# EAGLE design multi-pcb-cpu2 (EAGLE 9.6.2)
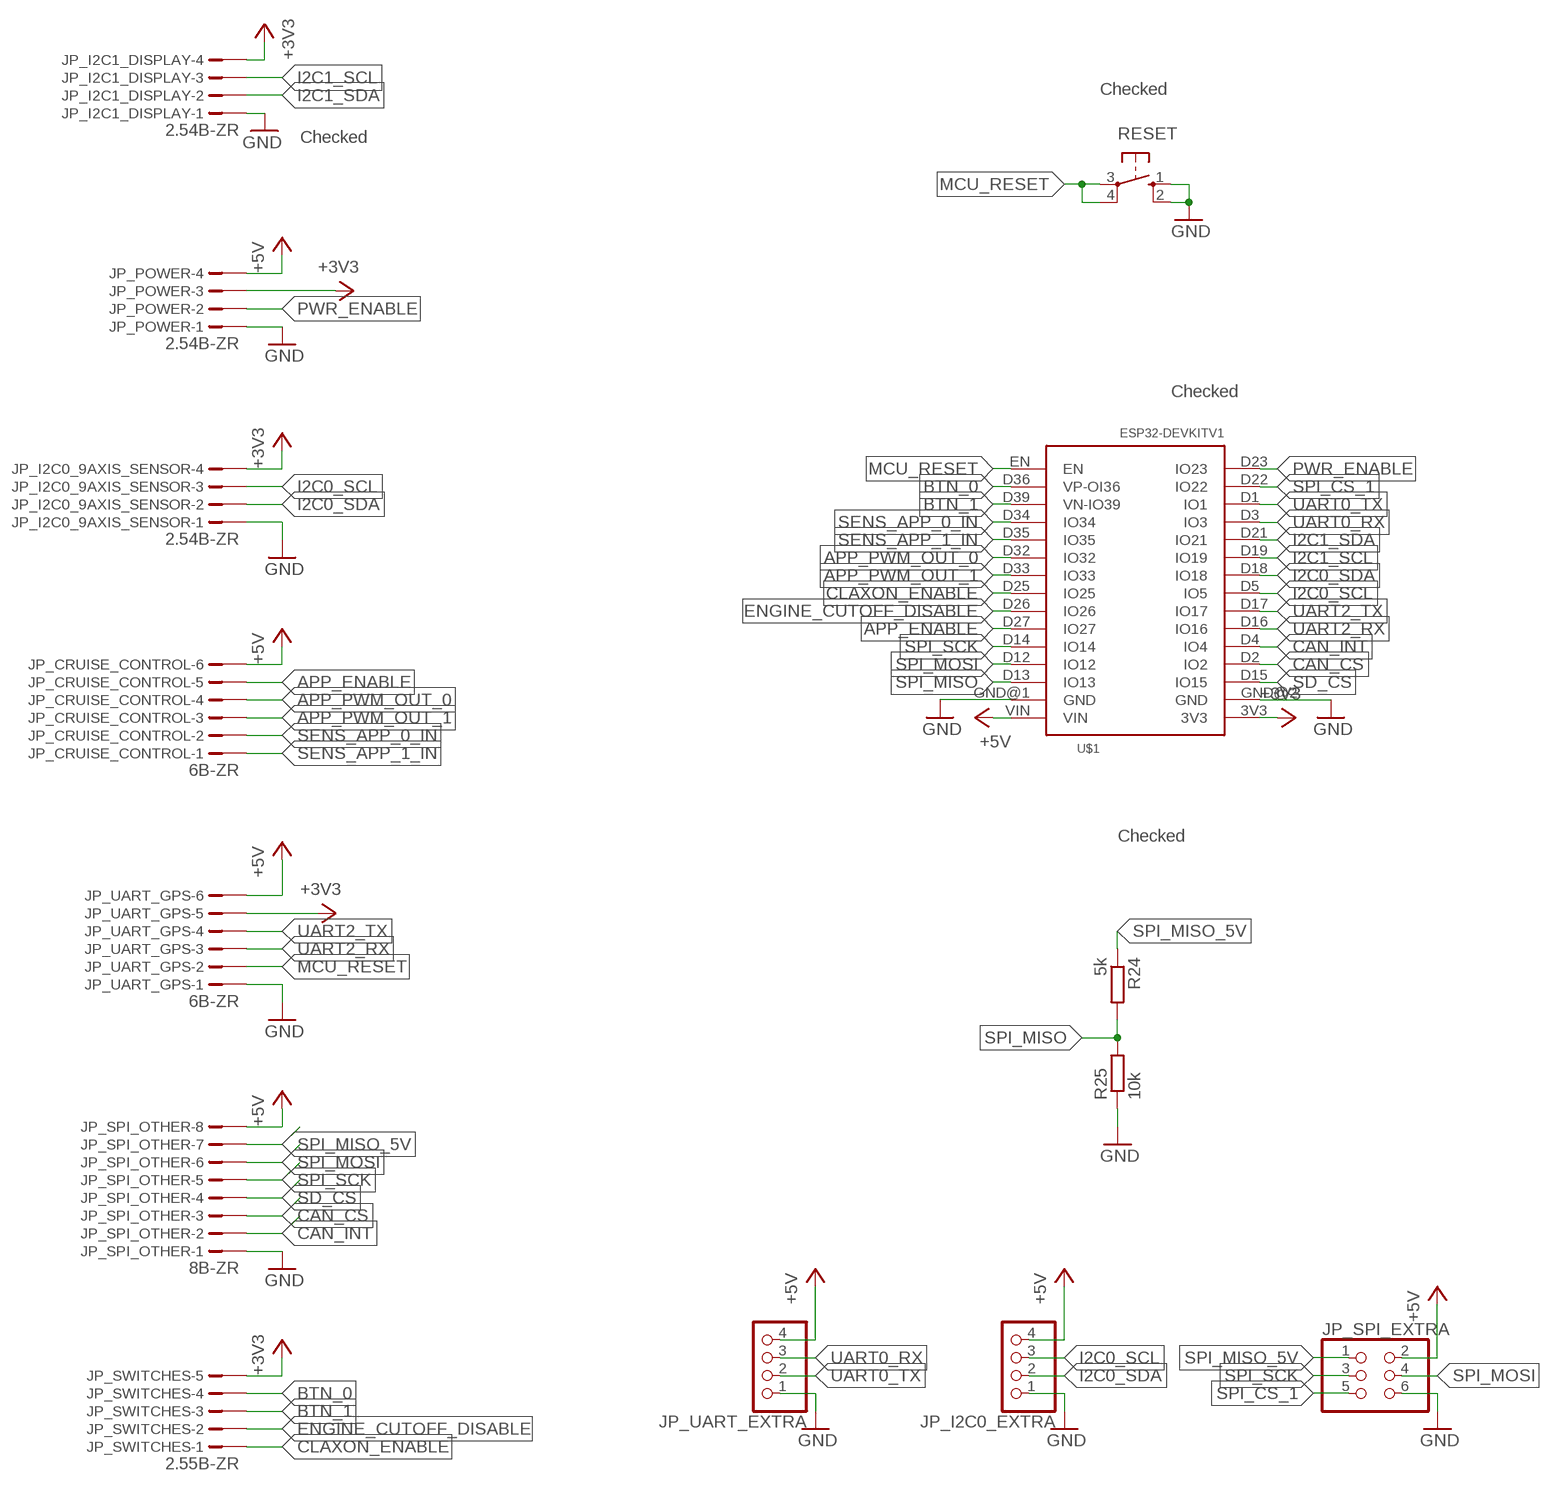
[diagram p0: schematic, sheet 1]

## Parts
JP_CRUISE_CONTROL  6B-ZR  [B6B-ZR2.5]
JP_I2C0_9AXIS_SENSOR  2.54B-ZR  [B4B-ZR2.5]
JP_I2C0_EXTRA  PINHD-1X4  [1X04]
JP_I2C1_DISPLAY  2.54B-ZR  [B4B-ZR2.5]
JP_POWER  2.54B-ZR  [B4B-ZR2.5]
JP_SPI_EXTRA  PINHD-2X3  [2X03]
JP_SPI_OTHER  8B-ZR  [B8B-ZR2.5]
JP_SWITCHES  2.55B-ZR  [B5B-ZR2.5]
JP_UART_EXTRA  PINHD-1X4  [1X04]
JP_UART_GPS  6B-ZR  [B6B-ZR2.5]
R24  5k  R-EU_0207/7  [0207/7]
R25  10k  R-EU_0207/7  [0207/7]
RESET  10-XX  [B3F-10XX]
U$1  ESP32DEVKITV1  [ESP32-DEVKITV1]

## Nets
+3V3: JP_I2C0_9AXIS_SENSOR.4 JP_I2C1_DISPLAY.4 JP_POWER.3 JP_SWITCHES.5 JP_UART_GPS.5 U$1.3V3
+5V: JP_CRUISE_CONTROL.6 JP_I2C0_EXTRA.4 JP_POWER.4 JP_SPI_EXTRA.2 JP_SPI_OTHER.8 JP_UART_EXTRA.4 JP_UART_GPS.6 U$1.VIN
APP_ENABLE: JP_CRUISE_CONTROL.5 U$1.D27(IO27)
APP_PWM_OUT_0: JP_CRUISE_CONTROL.4 U$1.D32(IO32)
APP_PWM_OUT_1: JP_CRUISE_CONTROL.3 U$1.D33(IO33)
BTN_0: JP_SWITCHES.4 U$1.D36(VP-OI36)
BTN_1: JP_SWITCHES.3 U$1.D39(VN-IO39)
CAN_CS: JP_SPI_OTHER.3 U$1.D2(IO2)
CAN_INT: JP_SPI_OTHER.2 U$1.D4(IO4)
CLAXON_ENABLE: JP_SWITCHES.1 U$1.D25(IO25)
ENGINE_CUTOFF_DISABLE: JP_SWITCHES.2 U$1.D26(IO26)
GND: JP_I2C0_9AXIS_SENSOR.1 JP_I2C0_EXTRA.1 JP_I2C1_DISPLAY.1 JP_POWER.1 JP_SPI_EXTRA.6 JP_SPI_OTHER.1 JP_UART_EXTRA.1 JP_UART_GPS.1 R25.1 RESET.1(S) RESET.2(S1) U$1.GND@1(GND) U$1.GND@2(GND)
I2C0_SCL: JP_I2C0_9AXIS_SENSOR.3 JP_I2C0_EXTRA.3 U$1.D5(IO5)
I2C0_SDA: JP_I2C0_9AXIS_SENSOR.2 JP_I2C0_EXTRA.2 U$1.D18(IO18)
I2C1_SCL: JP_I2C1_DISPLAY.3 U$1.D19(IO19)
I2C1_SDA: JP_I2C1_DISPLAY.2 U$1.D21(IO21)
MCU_RESET: JP_UART_GPS.2 RESET.3(P) RESET.4(P1) U$1.EN
PWR_ENABLE: JP_POWER.2 U$1.D23(IO23)
SD_CS: JP_SPI_OTHER.4 U$1.D15(IO15)
SENS_APP_0_IN: JP_CRUISE_CONTROL.2 U$1.D34(IO34)
SENS_APP_1_IN: JP_CRUISE_CONTROL.1 U$1.D35(IO35)
SPI_CS_1: JP_SPI_EXTRA.5 U$1.D22(IO22)
SPI_MISO: R24.2 R25.2 U$1.D13(IO13)
SPI_MISO_5V: JP_SPI_EXTRA.1 JP_SPI_OTHER.7 R24.1
SPI_MOSI: JP_SPI_EXTRA.4 JP_SPI_OTHER.6 U$1.D12(IO12)
SPI_SCK: JP_SPI_EXTRA.3 JP_SPI_OTHER.5 U$1.D14(IO14)
UART0_RX: JP_UART_EXTRA.3 U$1.D3(IO3)
UART0_TX: JP_UART_EXTRA.2 U$1.D1(IO1)
UART2_RX: JP_UART_GPS.3 U$1.D16(IO16)
UART2_TX: JP_UART_GPS.4 U$1.D17(IO17)

## Notes on the sheet
- Checked
- Checked
- Checked
- Checked

## Library data of the parts
JP_CRUISE_CONTROL JP_UART_GPS = con-jst-custom:?6B-ZR: ZH CONNECTOR 1.5 mm, 4 pin 1 row Source: http://www.jst.com .. eZH.pdf
JP_I2C0_9AXIS_SENSOR JP_I2C1_DISPLAY JP_POWER = con-jst-custom:?4B-ZR: ZH CONNECTOR 1.5 mm, 4 pin 1 row Source: http://www.jst.com .. eZH.pdf
JP_I2C0_EXTRA JP_UART_EXTRA = pinhead:PINHD-1X4: PIN HEADER
JP_SPI_EXTRA = pinhead:PINHD-2X3: PIN HEADER
JP_SPI_OTHER = con-jst-custom:?8B-ZR: ZH CONNECTOR 1.5 mm, 4 pin 1 row Source: http://www.jst.com .. eZH.pdf
JP_SWITCHES = con-jst-custom:?5B-ZR: ZH CONNECTOR 1.5 mm, 4 pin 1 row Source: http://www.jst.com .. eZH.pdf
R24 R25 = rcl:R-EU_: RESISTOR, European symbol; SPICEPREFIX: R
RESET = switch-omron:10-XX: OMRON SWITCH; MPN: B3F-1000; OC_FARNELL: 176432; OC_NEWARK: 36M3542
U$1 = ESP32-DEVKITV1:ESP32DEVKITV1

## Board
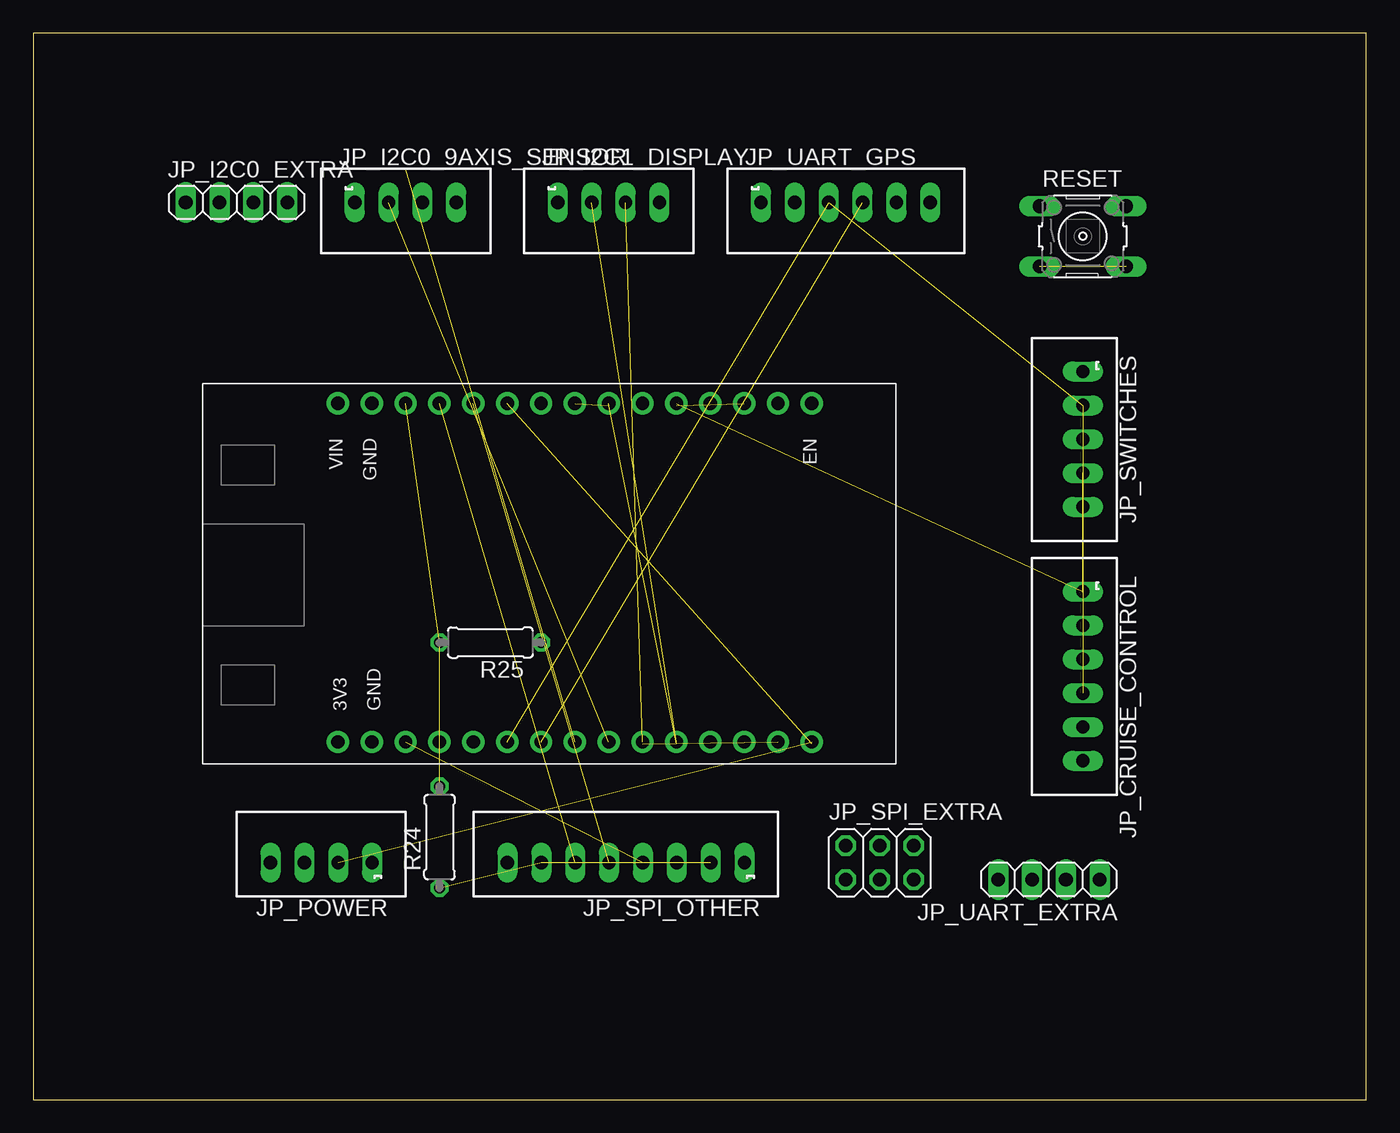
[diagram p1: board, top side]
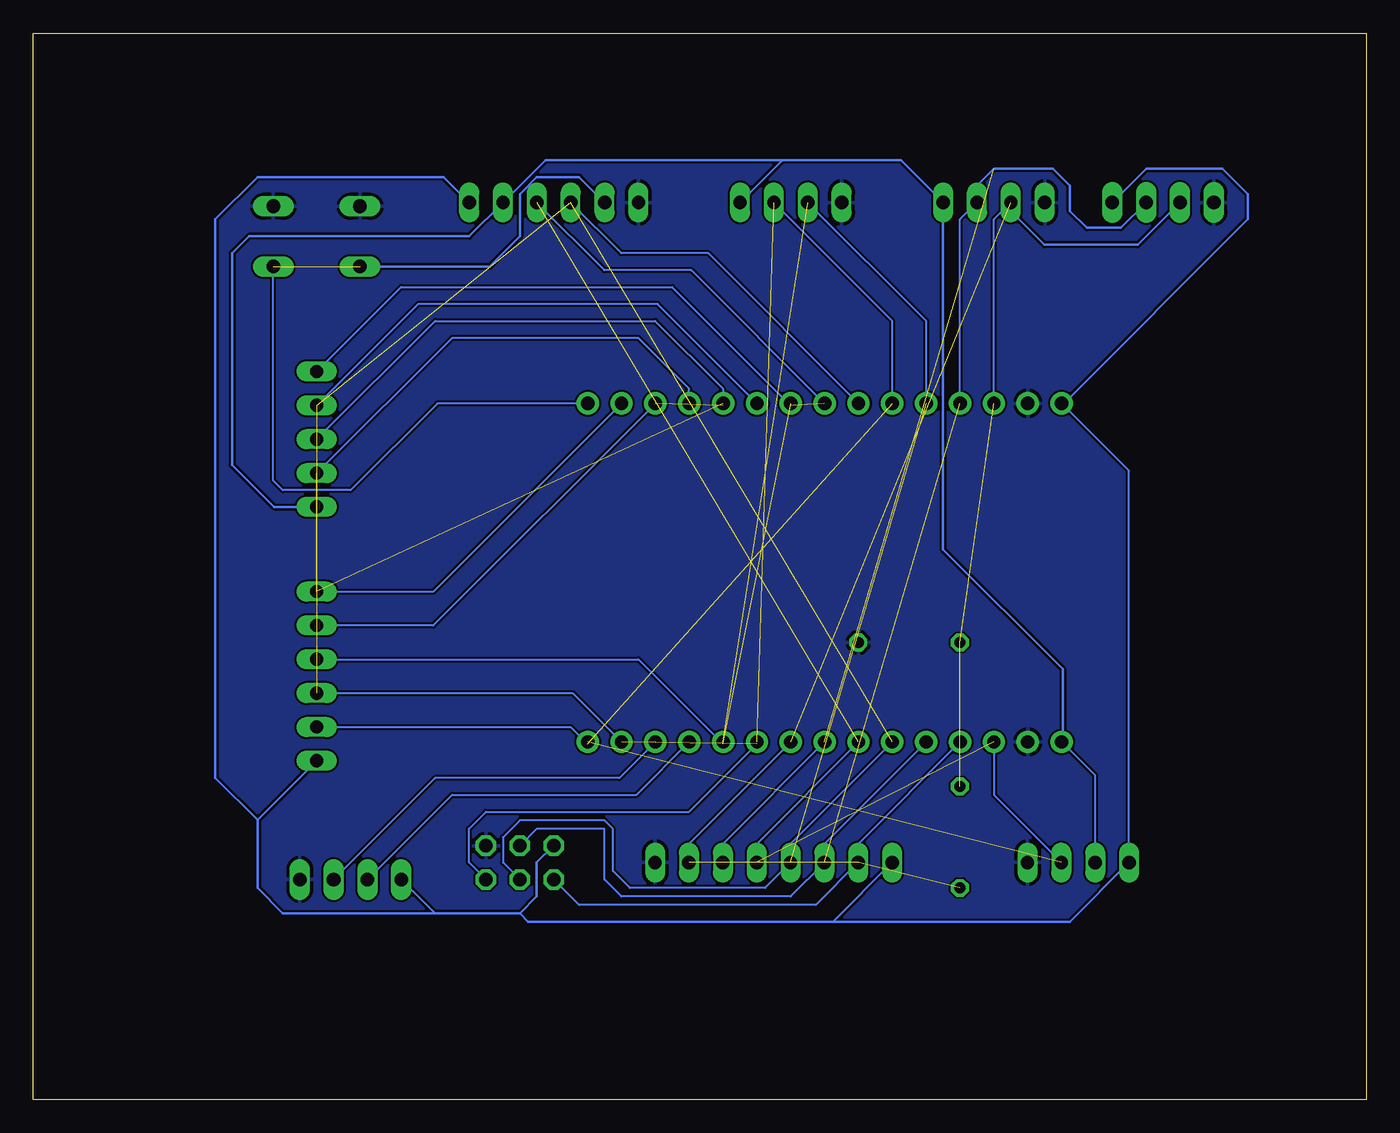
[diagram p2: board, bottom side, seen from below]

Size 100 x 80 mm. Coordinates in mm from the lower left corner, seen from the top.
Outline: 0,0 100,0 100,80 0,80 0,0
Copper layers (1*16): Top 0.035mm / dielectric 1.5mm / Bottom 0.035mm
Design rules "default": minimum track width 6mil, minimum drill 0.35mm, track to track 6mil, track to pad 6mil, pad to pad 6mil, via to via 6mil, smd to smd 6mil, copper to edge 40mil, drill to drill 6mil, minimum pad ring 10mil, minimum via ring 8mil, stop-mask expansion 4mil, vias tented up to drill 0mil, thermal gap 10mil

### Footprints (pad centres in the part's own frame; a part is rotated, then mirrored left to right if it is on the bottom)
B6B-ZR2.5 = drill 1 pad 1.422 long: 1 -6.365,0; 2 -3.823,0; 3 -1.283,0; 4 1.257,0; 5 3.797,0; 6 6.337,0
B4B-ZR2.5 = drill 1 pad 1.422 long: 1 -3.825,0; 2 -1.283,0; 3 1.257,0; 4 3.797,0
1X04 = drill 1.016 long: 1 -3.81,0; 2 -1.27,0; 3 1.27,0; 4 3.81,0
2X03 = drill 1.016 octagon: 1 -2.54,-1.27; 2 -2.54,1.27; 3 0,-1.27; 4 0,1.27; 5 2.54,-1.27; 6 2.54,1.27
B8B-ZR2.5 = drill 1 pad 1.422 long: 1 -8.905,0; 2 -6.363,0; 3 -3.823,0; 4 -1.283,0; 5 1.257,0; 6 3.797,0; 7 6.337,0; 8 8.877,0
B5B-ZR2.5 = drill 1 pad 1.422 long: 1 -5.095,0; 2 -2.553,0; 3 -0.013,0; 4 2.527,0; 5 5.067,0
0207/7 = drill 0.813 octagon: 1 -3.81,0; 2 3.81,0
B3F-10XX = drill 1.016 long: 1 -3.251,2.261; 2 3.251,2.261; 3 -3.251,-2.261; 4 3.251,-2.261
ESP32-DEVKITV1 = drill 1 pad 1.676: 3V3 -15.25,-12.54; D1 15.23,-12.54; D2 -7.63,-12.54; D3 12.69,-12.54; D4 -5.09,-12.54; D5 2.53,-12.54; D12 -7.63,12.865; D13 -10.17,12.865; D14 -5.09,12.865; D15 -10.17,-12.54; D16 -2.55,-12.54; D17 -0.01,-12.54; D18 5.07,-12.54; D19 7.61,-12.54; D21 10.15,-12.54; D22 17.77,-12.54; D23 20.31,-12.54; D25 2.53,12.865; D26 -0.01,12.865; D27 -2.55,12.865; D32 7.61,12.865; D33 5.07,12.865; D34 12.69,12.865; D35 10.15,12.865; D36 17.77,12.865; D39 15.23,12.865; EN 20.31,12.865; GND@1 -12.71,12.865; GND@2 -12.71,-12.54; VIN -15.25,12.865

### Placement (x,y rotation side)
JP_CRUISE_CONTROL  78.74,31.75 270 top
JP_I2C0_9AXIS_SENSOR  27.94,67.31 0 top
JP_I2C0_EXTRA  15.24,67.31 0 top
JP_I2C1_DISPLAY  43.18,67.31 0 top
JP_POWER  21.59,17.78 180 top
JP_SPI_EXTRA  63.5,17.78 0 top
JP_SPI_OTHER  44.45,17.78 180 top
JP_SWITCHES  78.74,49.53 270 top
JP_UART_EXTRA  76.2,16.51 180 top
JP_UART_GPS  60.96,67.31 0 top
R24  30.48,19.68 90 top
R25  34.29,34.29 180 top
RESET  78.74,64.77 0 top
U$1  38.1,39.37 0 top

### Tracks (layer width: path | path; a pad name or v marks a point on that pad's centre or on a via)
+3V3
  Bottom 0.152: JP_POWER.3 20.33,24.31 22.77,26.75 U$1.3V3
  Bottom 0.203: JP_I2C0_9AXIS_SENSOR.4 34.91,70.48 43.8,70.48 | 43.8,70.48 JP_I2C1_DISPLAY.4 | 43.8,70.48 61.58,70.48 JP_UART_GPS.5 67.3,64.77 83.82,64.77 85.09,63.5 85.09,47.62 81.93,44.46 JP_SWITCHES.5 | JP_I2C0_9AXIS_SENSOR.4 31.74,68.59 | JP_I2C0_9AXIS_SENSOR.4 31.75,67.3 31.75,41.27 22.77,32.3 22.77,26.75
+5V
  Bottom 0.152: JP_POWER.4 17.79,47.18 22.77,52.16 U$1.VIN
  Bottom 0.203: JP_SPI_EXTRA.2 62.23,17.78 62.23,15.24 63.5,13.97 | 69.85,13.97 JP_UART_EXTRA.4 | 63.5,13.97 69.85,13.97 | JP_SPI_OTHER.8 40.02,13.34 | 63.5,13.97 62.87,13.34 40.02,13.34 | JP_POWER.4 22.24,13.34 40.02,13.34 | JP_CRUISE_CONTROL.6 83.19,20.97 | 83.19,20.97 83.19,15.88 81.28,13.97 69.85,13.97 | JP_UART_GPS.6 69.2,69.22 83.19,69.22 86.36,66.04 86.36,24.14 83.19,20.97 | JP_I2C0_EXTRA.4 16.51,69.85 10.79,69.85 8.89,67.94 8.89,66.04 22.77,52.16
APP_ENABLE  (1 unrouted)
  Bottom 0.152: U$1.D27 35.55,58.41 44.45,67.31 | JP_CRUISE_CONTROL.5 78.73,27.94 59.69,27.94 58.42,26.67
APP_PWM_OUT_0  (1 unrouted)
  Bottom 0.152: U$1.D32 53.16,59.69 71.12,59.69 78.74,52.07
APP_PWM_OUT_1  (1 unrouted)
  Bottom 0.152: JP_CRUISE_CONTROL.3 78.73,33.02 54.61,33.02 48.26,26.67
BTN_0  (1 unrouted)
  Bottom 0.152: U$1.D36 70,38.1 78.74,38.1
BTN_1  (1 unrouted)
  Bottom 0.152: JP_SWITCHES.3 78.73,49.54 69.85,58.42 53.34,58.42 48.26,53.34 48.26,52.07 | U$1.D39 70,35.56 78.74,35.56
CAN_CS  (1 unrouted)
  Bottom 0.152: U$1.D2 38.1,19.2 38.1,17.78
CAN_INT  (1 unrouted)
  Bottom 0.152: U$1.D4 40.64,19.2 40.64,17.78
CLAXON_ENABLE  (1 unrouted)
  Bottom 0.152: U$1.D25 50.62,62.23 57.15,62.23 62.23,67.31 | JP_SWITCHES.1 72.41,60.96 52.07,60.96 43.18,52.07
ENGINE_CUTOFF_DISABLE  (1 unrouted)
  Bottom 0.152: U$1.D26 49.35,63.5 55.88,63.5 59.69,67.31
GND
  pour Bottom: 0,80.01 0,0 99.69,0 99.69,80.01
I2C0_SCL  (1 unrouted)
  Bottom 0.152: U$1.D5 48.26,19.2 48.26,17.78
  Bottom 0.203: JP_I2C0_EXTRA.3 18.41,65.41 20.95,65.41 22.23,66.67 22.23,68.58 23.5,69.85 27.93,69.85 29.2,68.58 JP_I2C0_9AXIS_SENSOR.3
I2C0_SDA  (1 unrouted)
  Bottom 0.152: U$1.D18 50.8,19.2 50.8,17.78
  Bottom 0.203: JP_I2C0_EXTRA.2 17.14,64.14 24.13,64.14 26.66,66.66 JP_I2C0_9AXIS_SENSOR.2
I2C1_SCL  (1 unrouted)
I2C1_SDA  (1 unrouted)
MCU_RESET  (1 unrouted)
  Bottom 0.152: U$1.EN 69.69,52.23 76.2,45.72 81.28,45.72 81.99,46.43 RESET.4
  Bottom 0.203: JP_UART_GPS.2 59.04,69.22 62.23,69.22 63.5,67.94 63.5,64.77 65.76,62.51 RESET.3
PWR_ENABLE  (1 unrouted)
SD_CS  (1 unrouted)
  Bottom 0.152: U$1.D15 27.93,22.85 22.86,17.78
SENS_APP_0_IN  (1 unrouted)
  Bottom 0.152: U$1.D34 50.79,53.33 54.61,57.15 68.58,57.15 78.74,46.99
SENS_APP_1_IN  (1 unrouted)
SPI_CS_1  (1 unrouted)
  Bottom 0.152: U$1.D22 59.52,30.48 78.74,30.48 | JP_SPI_EXTRA.5 67.31,17.78 67.31,20.32 66.04,21.59 50.8,21.59 45.72,26.67
SPI_MISO  (2 unrouted)
  Bottom 0.152: U$1.D13 27.93,66.05 26.67,67.31
SPI_MISO_5V  (1 unrouted)
  Bottom 0.152: JP_SPI_OTHER.7 41.29,14.61 59.05,14.61 JP_SPI_EXTRA.1
SPI_MOSI  (1 unrouted)
  Bottom 0.152: U$1.D12 30.47,66.05 29.21,67.31 | JP_SPI_OTHER.6 40.65,17.77 43.18,15.24 55.88,15.24 57.15,16.51 57.15,20.32 62.23,20.32 JP_SPI_EXTRA.4
SPI_SCK  (1 unrouted)
  Bottom 0.152: U$1.D14 33.01,58.41 41.91,67.31 | JP_SPI_OTHER.5 45.1,15.88 55.24,15.88 56.52,17.14 56.52,20.32 57.15,20.95 63.5,20.95 64.77,19.68 64.77,17.78 JP_SPI_EXTRA.3
UART0_RX
  Bottom 0.152: JP_UART_EXTRA.3 68.58,22.86 54.76,22.86 U$1.D3
UART0_TX
  Bottom 0.152: U$1.D1 56.03,24.13 69.85,24.13 JP_UART_EXTRA.2
UART2_RX  (1 unrouted)
  Bottom 0.152: U$1.D16 43.18,19.2 43.18,17.78
UART2_TX  (1 unrouted)
  Bottom 0.152: U$1.D17 45.72,19.2 45.72,17.78